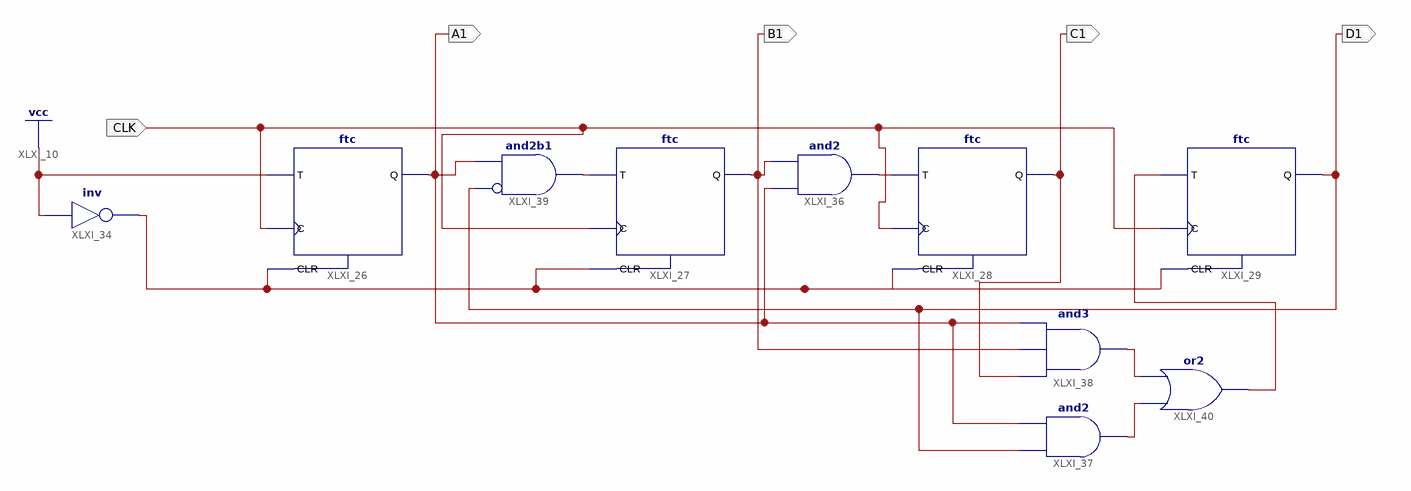
[diagram p0: schematic sheet 1]
// Xilinx ISE schematic counter.sch (spartan6) as structural Verilog: 10 symbols, 5 ports
module counter (
  input  CLK,
  output B1,
  output C1,
  output A1,
  output D1
);

  wire XLXN_38, XLXN_51, XLXN_58, XLXN_61, XLXN_62, XLXN_74;

  ftc XLXI_26 (.C(CLK), .CLR(XLXN_38), .T(1'b1), .Q(A1));
  not XLXI_34 (XLXN_38, 1'b1);
  and XLXI_36 (XLXN_58, A1, B1);
  ftc XLXI_28 (.C(CLK), .CLR(XLXN_38), .T(XLXN_58), .Q(C1));
  ftc XLXI_29 (.C(CLK), .CLR(XLXN_38), .T(XLXN_74), .Q(D1));
  ftc XLXI_27 (.C(CLK), .CLR(XLXN_38), .T(XLXN_51), .Q(B1));
  and XLXI_39 (XLXN_51, ~D1, A1);  // and2b1
  or XLXI_40 (XLXN_74, XLXN_62, XLXN_61);
  and XLXI_38 (XLXN_61, C1, B1, A1);
  and XLXI_37 (XLXN_62, D1, A1);
endmodule
